# EAGLE design Copy #1 of 01 (EAGLE 5.09)
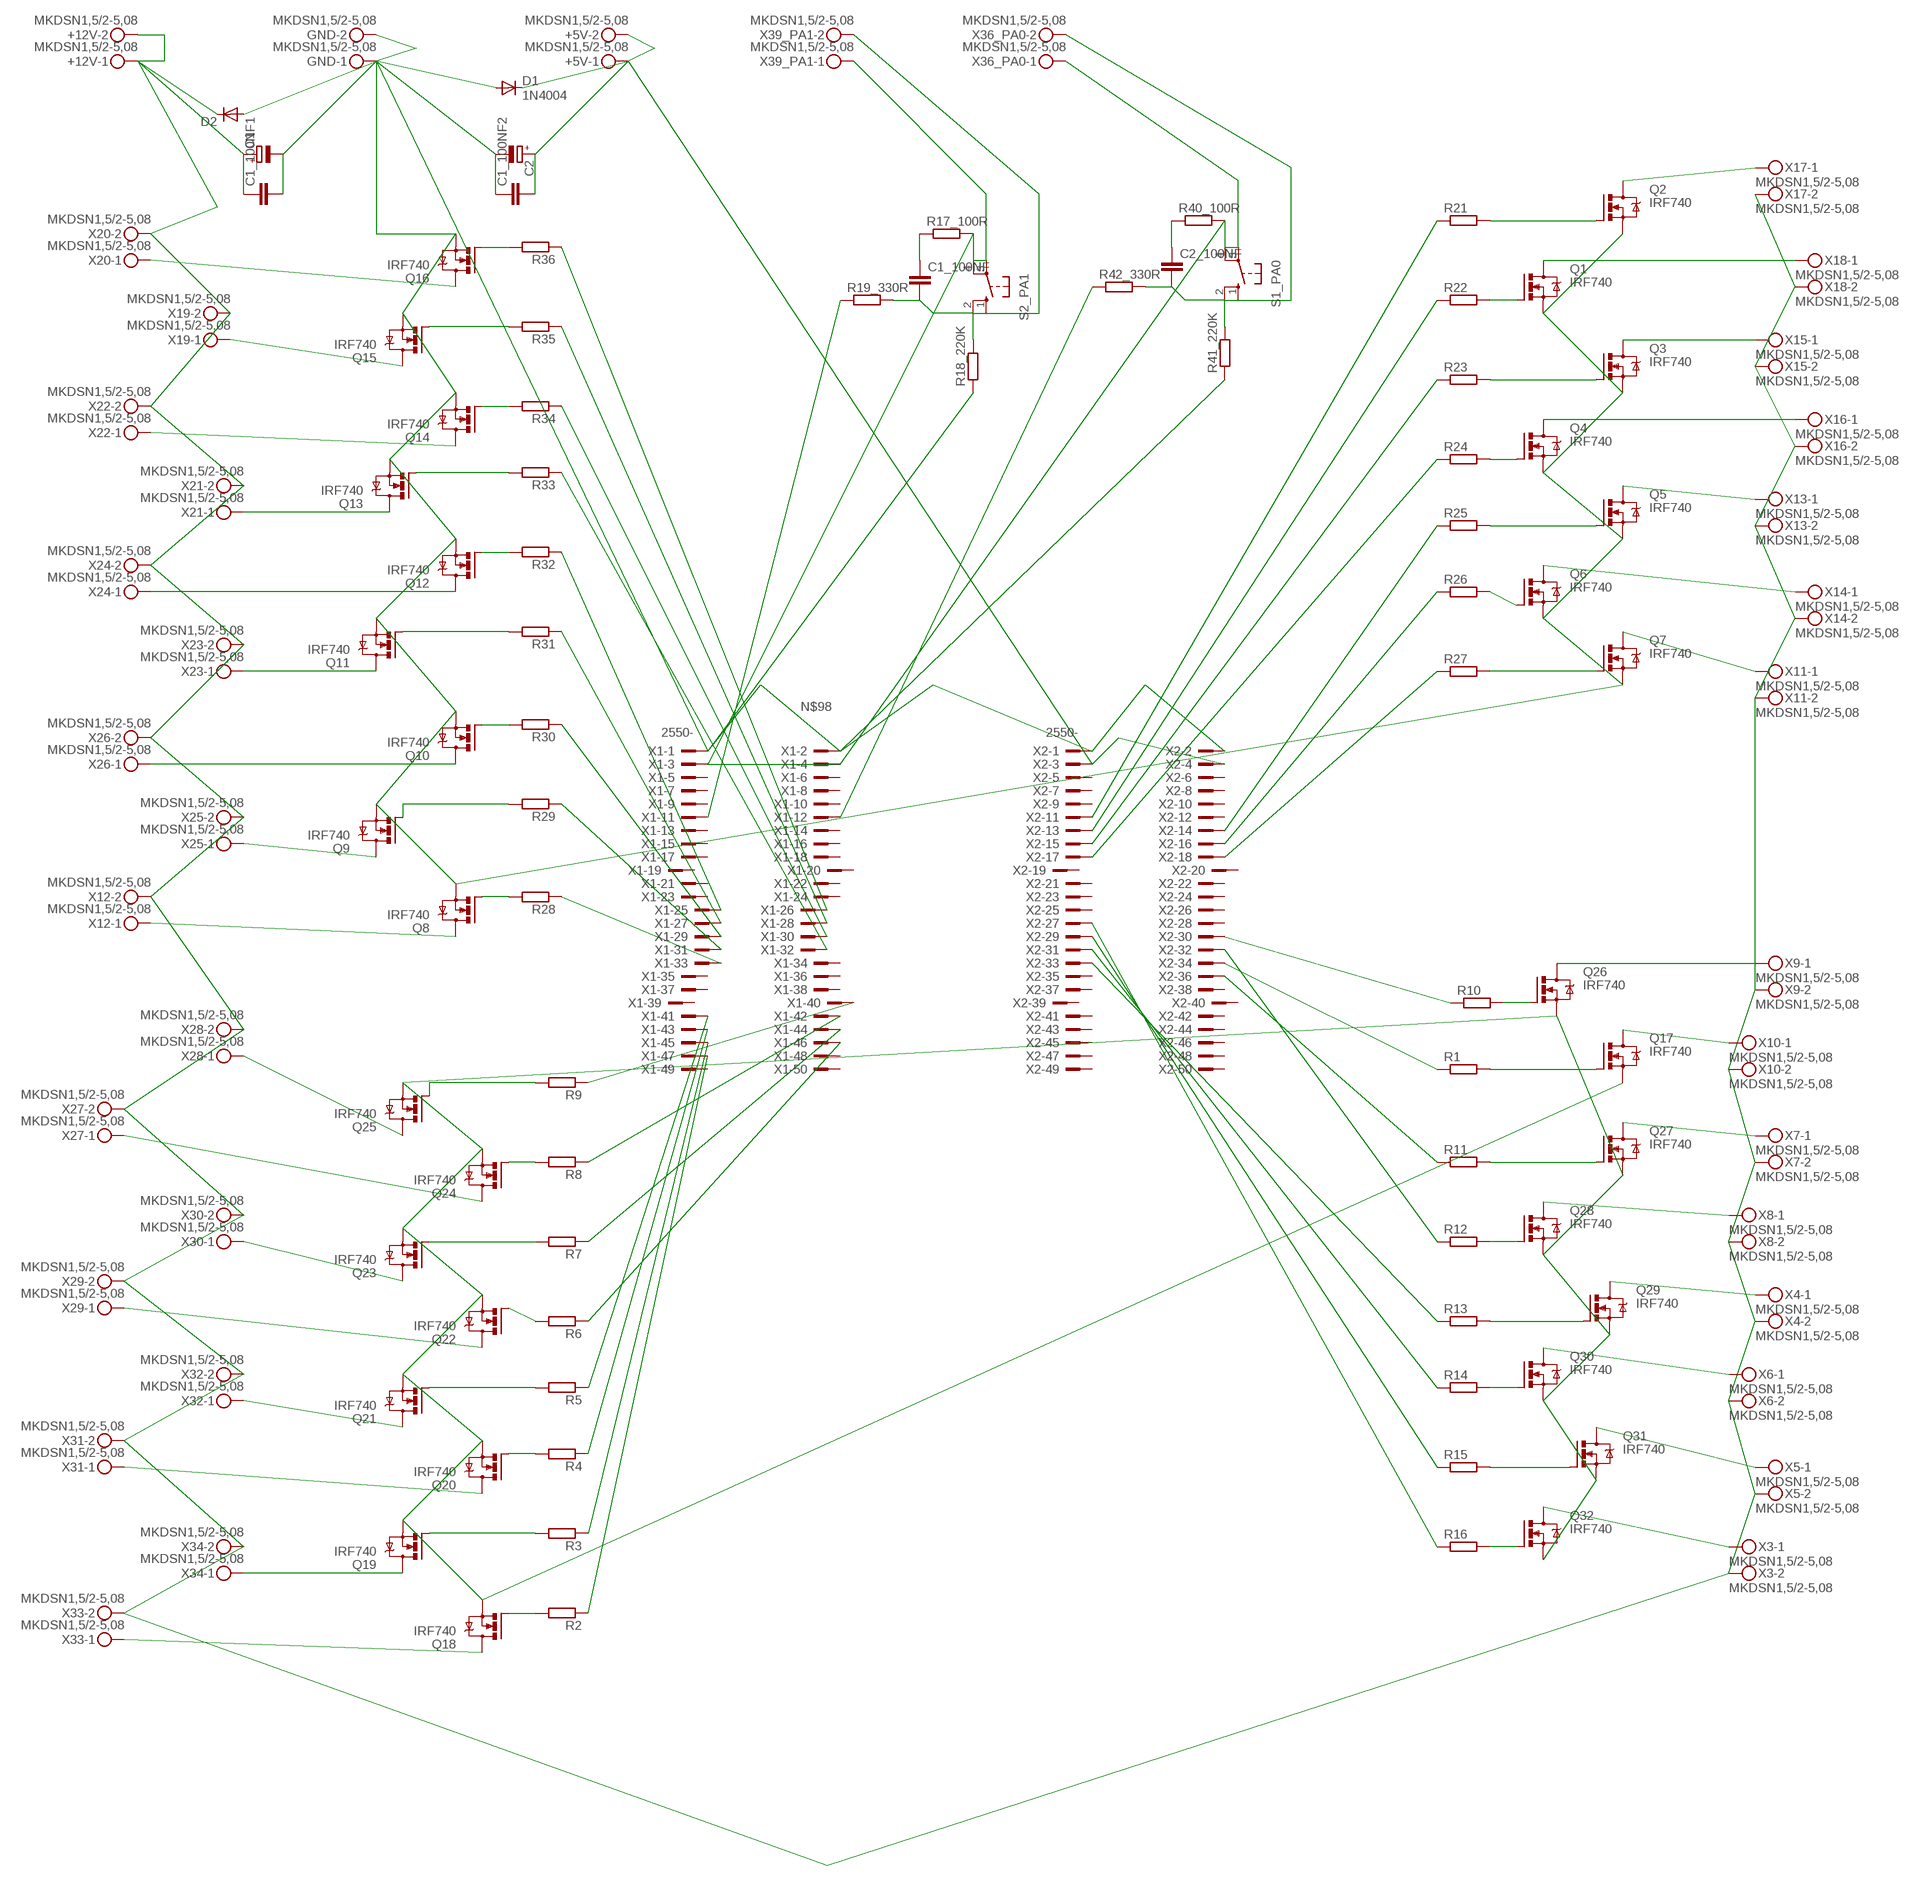
[diagram p0: schematic, sheet 1]

## Parts
+5V  MKDSN1,5/2-5,08  [MKDSN1,5/2-5,08]
+12V  MKDSN1,5/2-5,08  [MKDSN1,5/2-5,08]
C1  CPOL-EUTT5D10  [TT5D10]
C1_100NF  C-EU050-035X075  [C050-035X075]
C1_100NF1  C-EU050-035X075  [C050-035X075]
C1_100NF2  C-EU050-035X075  [C050-035X075]
C2  CPOL-EUTT5D10  [TT5D10]
C2_100NF  C-EU050-035X075  [C050-035X075]
D1  1N4004  [DO41-10]
D2  DIODE-C2673  [C2673]
GND  MKDSN1,5/2-5,08  [MKDSN1,5/2-5,08]
Q1  IRF740  [TO220BV]
Q2  IRF740  [TO220BV]
Q3  IRF740  [TO220BV]
Q4  IRF740  [TO220BV]
Q5  IRF740  [TO220BV]
Q6  IRF740  [TO220BV]
Q7  IRF740  [TO220BV]
Q8  IRF740  [TO220BV]
Q9  IRF740  [TO220BV]
Q10  IRF740  [TO220BV]
Q11  IRF740  [TO220BV]
Q12  IRF740  [TO220BV]
Q13  IRF740  [TO220BV]
Q14  IRF740  [TO220BV]
Q15  IRF740  [TO220BV]
Q16  IRF740  [TO220BV]
Q17  IRF740  [TO220BV]
Q18  IRF740  [TO220BV]
Q19  IRF740  [TO220BV]
Q20  IRF740  [TO220BV]
Q21  IRF740  [TO220BV]
Q22  IRF740  [TO220BV]
Q23  IRF740  [TO220BV]
Q24  IRF740  [TO220BV]
Q25  IRF740  [TO220BV]
Q26  IRF740  [TO220BV]
Q27  IRF740  [TO220BV]
Q28  IRF740  [TO220BV]
Q29  IRF740  [TO220BV]
Q30  IRF740  [TO220BV]
Q31  IRF740  [TO220BV]
Q32  IRF740  [TO220BV]
R1  R-EU_0207/10  [0207/10]
R2  R-EU_0207/10  [0207/10]
R3  R-EU_0207/10  [0207/10]
R4  R-EU_0207/10  [0207/10]
R5  R-EU_0207/10  [0207/10]
R6  R-EU_0207/10  [0207/10]
R7  R-EU_0207/10  [0207/10]
R8  R-EU_0207/10  [0207/10]
R9  R-EU_0207/10  [0207/10]
R10  R-EU_0207/10  [0207/10]
R11  R-EU_0207/10  [0207/10]
R12  R-EU_0207/10  [0207/10]
R13  R-EU_0207/10  [0207/10]
R14  R-EU_0207/10  [0207/10]
R15  R-EU_0207/10  [0207/10]
R16  R-EU_0207/10  [0207/10]
R17_100R  R-EU_0207/10  [0207/10]
R18_220K  R-EU_0207/10  [0207/10]
R19_330R  R-EU_0207/10  [0207/10]
R21  R-EU_0207/10  [0207/10]
R22  R-EU_0207/10  [0207/10]
R23  R-EU_0207/10  [0207/10]
R24  R-EU_0207/10  [0207/10]
R25  R-EU_0207/10  [0207/10]
R26  R-EU_0207/10  [0207/10]
R27  R-EU_0207/10  [0207/10]
R28  R-EU_0207/10  [0207/10]
R29  R-EU_0207/10  [0207/10]
R30  R-EU_0207/10  [0207/10]
R31  R-EU_0207/10  [0207/10]
R32  R-EU_0207/10  [0207/10]
R33  R-EU_0207/10  [0207/10]
R34  R-EU_0207/10  [0207/10]
R35  R-EU_0207/10  [0207/10]
R36  R-EU_0207/10  [0207/10]
R40_100R  R-EU_0207/10  [0207/10]
R41_220K  R-EU_0207/10  [0207/10]
R42_330R  R-EU_0207/10  [0207/10]
S1_PA0  10-XX  [B3F-10XX]
S2_PA1  10-XX  [B3F-10XX]
X1  2550-  [PAK100/2500-50]
X2  2550-  [PAK100/2500-50]
X3  MKDSN1,5/2-5,08  [MKDSN1,5/2-5,08]
X4  MKDSN1,5/2-5,08  [MKDSN1,5/2-5,08]
X5  MKDSN1,5/2-5,08  [MKDSN1,5/2-5,08]
X6  MKDSN1,5/2-5,08  [MKDSN1,5/2-5,08]
X7  MKDSN1,5/2-5,08  [MKDSN1,5/2-5,08]
X8  MKDSN1,5/2-5,08  [MKDSN1,5/2-5,08]
X9  MKDSN1,5/2-5,08  [MKDSN1,5/2-5,08]
X10  MKDSN1,5/2-5,08  [MKDSN1,5/2-5,08]
X11  MKDSN1,5/2-5,08  [MKDSN1,5/2-5,08]
X12  MKDSN1,5/2-5,08  [MKDSN1,5/2-5,08]
X13  MKDSN1,5/2-5,08  [MKDSN1,5/2-5,08]
X14  MKDSN1,5/2-5,08  [MKDSN1,5/2-5,08]
X15  MKDSN1,5/2-5,08  [MKDSN1,5/2-5,08]
X16  MKDSN1,5/2-5,08  [MKDSN1,5/2-5,08]
X17  MKDSN1,5/2-5,08  [MKDSN1,5/2-5,08]
X18  MKDSN1,5/2-5,08  [MKDSN1,5/2-5,08]
X19  MKDSN1,5/2-5,08  [MKDSN1,5/2-5,08]
X20  MKDSN1,5/2-5,08  [MKDSN1,5/2-5,08]
X21  MKDSN1,5/2-5,08  [MKDSN1,5/2-5,08]
X22  MKDSN1,5/2-5,08  [MKDSN1,5/2-5,08]
X23  MKDSN1,5/2-5,08  [MKDSN1,5/2-5,08]
X24  MKDSN1,5/2-5,08  [MKDSN1,5/2-5,08]
X25  MKDSN1,5/2-5,08  [MKDSN1,5/2-5,08]
X26  MKDSN1,5/2-5,08  [MKDSN1,5/2-5,08]
X27  MKDSN1,5/2-5,08  [MKDSN1,5/2-5,08]
X28  MKDSN1,5/2-5,08  [MKDSN1,5/2-5,08]
X29  MKDSN1,5/2-5,08  [MKDSN1,5/2-5,08]
X30  MKDSN1,5/2-5,08  [MKDSN1,5/2-5,08]
X31  MKDSN1,5/2-5,08  [MKDSN1,5/2-5,08]
X32  MKDSN1,5/2-5,08  [MKDSN1,5/2-5,08]
X33  MKDSN1,5/2-5,08  [MKDSN1,5/2-5,08]
X34  MKDSN1,5/2-5,08  [MKDSN1,5/2-5,08]
X36_PA0  MKDSN1,5/2-5,08  [MKDSN1,5/2-5,08]
X39_PA1  MKDSN1,5/2-5,08  [MKDSN1,5/2-5,08]

## Nets
N$1: Q2.G R21.2
N$2: Q17.G R1.2
N$3: Q18.G R2.2
N$4: Q19.G R3.2
N$5: Q20.G R4.2
N$6: Q23.G R7.2
N$7: Q22.G R6.2
N$8: Q21.G R5.2
N$9: Q24.G R8.2
N$10: Q25.G R9.2
N$11: Q26.G R10.2
N$12: Q32.G R16.2
N$13: Q31.G R15.2
N$14: Q30.G R14.2
N$15: Q29.G R13.2
N$16: Q28.G R12.2
N$17: Q27.G R11.2
N$18: Q1.G R22.2
N$19: Q3.G R23.2
N$20: Q4.G R24.2
N$21: Q7.G R27.2
N$22: Q6.G R26.2
N$23: Q5.G R25.2
N$24: Q8.G R28.2
N$25: Q9.G R29.2
N$26: Q10.G R30.2
N$27: Q16.G R36.2
N$28: Q15.G R35.2
N$29: Q14.G R34.2
N$30: Q13.G R33.2
N$31: Q12.G R32.2
N$32: Q11.G R31.2
N$34: Q17.S Q18.S Q19.S Q20.S Q21.S Q22.S Q23.S Q24.S Q25.S Q26.S Q27.S Q28.S Q29.S Q30.S Q31.S Q32.S
N$35: R2.1 X1.47
N$36: R3.1 X1.45
N$37: R4.1 X1.43
N$38: R5.1 X1.41
N$39: R6.1 X1.46
N$40: R7.1 X1.44
N$41: R8.1 X1.42
N$42: R9.1 X1.40
N$43: R10.1 X2.30
N$44: R11.1 X2.36
N$45: R1.1 X2.34
N$46: R12.1 X2.32
N$47: R13.1 X2.33
N$48: R14.1 X2.31
N$49: R15.1 X2.29
N$50: R16.1 X2.27
N$51: R21.1 X2.11
N$52: R22.1 X2.13
N$53: R23.1 X2.15
N$54: R24.1 X2.17
N$55: R25.1 X2.14
N$56: R26.1 X2.16
N$57: R27.1 X2.18
N$58: R28.1 X1.33
N$59: R36.1 X1.26
N$60: R35.1 X1.28
N$61: R34.1 X1.30
N$62: R33.1 X1.32
N$63: R32.1 X1.25
N$64: R31.1 X1.27
N$65: R30.1 X1.29
N$66: R29.1 X1.31
N$67: Q7.D X11.1
N$68: Q6.D X14.1
N$69: Q5.D X13.1
N$70: Q4.D X16.1
N$71: Q3.D X15.1
N$72: Q1.D X18.1
N$73: Q2.D X17.1
N$74: Q26.D X9.1
N$75: Q17.D X10.1
N$76: Q27.D X7.1
N$77: Q28.D X8.1
N$78: Q29.D X4.1
N$79: Q30.D X6.1
N$80: Q31.D X5.1
N$81: Q32.D X3.1
N$82: Q18.D X33.1
N$83: Q19.D X34.1
N$84: Q20.D X31.1
N$85: Q21.D X32.1
N$86: Q22.D X29.1
N$87: Q23.D X30.1
N$88: Q24.D X27.1
N$89: Q25.D X28.1
N$90: Q8.D X12.1
N$91: Q9.D X25.1
N$92: Q10.D X26.1
N$93: Q11.D X23.1
N$94: Q12.D X24.1
N$95: Q13.D X21.1
N$96: Q14.D X22.1
N$97: Q15.D X19.1
N$98: C1.- C1_100NF1.2 C1_100NF2.1 C2.- D1.A D2.A GND.1 GND.2 Q1.S Q2.S Q3.S Q4.S Q5.S Q6.S Q7.S Q8.S Q9.S Q10.S Q11.S Q12.S Q13.S Q14.S Q15.S Q16.S R18_220K.1 R41_220K.1 X1.1 X1.2 X2.1 X2.2
N$99: +12V.1 +12V.2 C1.+ C1_100NF1.1 D2.C X3.2 X4.2 X5.2 X6.2 X7.2 X8.2 X9.2 X10.2 X11.2 X12.2 X13.2 X14.2 X15.2 X16.2 X17.2 X18.2 X19.2 X20.2 X21.2 X22.2 X23.2 X24.2 X25.2 X26.2 X27.2 X28.2 X29.2 X30.2 X31.2 X32.2 X33.2 X34.2
N$100: +5V.1 +5V.2 C1_100NF2.2 C2.+ D1.C X2.3 X2.4
N$101: C2_100NF.2 R41_220K.2 R42_330R.2 S1_PA0.1(S) S1_PA0.2(S1) X36_PA0.2
N$102: C2_100NF.1 R40_100R.1
N$103: Q16.D X20.1
N$104: C1_100NF.2 R18_220K.2 R19_330R.2 S2_PA1.1(S) S2_PA1.2(S1) X39_PA1.2
N$105: C1_100NF.1 R17_100R.1
N$106: R17_100R.2 R40_100R.2 S1_PA0.3(P) S1_PA0.4(P1) S2_PA1.3(P) S2_PA1.4(P1) X1.3 X1.4 X36_PA0.1 X39_PA1.1
N$107: R19_330R.1 X1.11
N$108: R42_330R.1 X1.12
Unconnected: X1.5 X1.6 X1.7 X1.8 X1.9 X1.10 X1.13 X1.14 X1.15 X1.16 X1.17 X1.18 X1.19 X1.20 X1.21 X1.22 X1.23 X1.24 X1.34 X1.35 X1.36 X1.37 X1.38 X1.39 X1.48 X1.49 X1.50 X2.5 X2.6 X2.7 X2.8 X2.9 X2.10 X2.12 X2.19 X2.20 X2.21 X2.22 X2.23 X2.24 X2.25 X2.26 X2.28 X2.35 X2.37 X2.38 X2.39 X2.40 X2.41 X2.42 X2.43 X2.44 X2.45 X2.46 X2.47 X2.48 X2.49 X2.50

## Library data of the parts
+5V +12V GND X3-X34 X36_PA0 X39_PA1 = con-phoenix-508:MKDSN1,5/2-5,08: MKDSN 1,5/ 2-5,08 Printklemme Nennstrom: 13,5 A Nennspannung: 250 V Rastermaß: 5,08 mm Polzahl: 2 Anschlussart: Schraubanschluss Montage: Löten Anschlussrichtung Leiter/Platine: 0 ° Artikelnummer: 1729128 Source: http://eshop.phoenixcontact.com .. 1729128.pdf
C1 C2 = resistor:CPOL-EU: POLARIZED CAPACITOR, European symbol
C1_100NF C1_100NF1 C1_100NF2 C2_100NF = resistor:C-EU: CAPACITOR, European symbol
D1 = diode:1N4004: DIODE general purpose rectifier, 1 A
D2 = diode:DIODE-: DIODE
Q1-Q32 = transistor-power:IRF740: N-CHANNEL MOS FET
R1-R16 R17_100R R18_220K R19_330R R21-R36 R40_100R R41_220K R42_330R = resistor:R-EU_: RESISTOR, European symbol
S1_PA0 S2_PA1 = switch-omron:10-XX: OMRON SWITCH
X1 X2 = con-3m:2550-: 3M (TM) Pak 100 4-Wall Header Source: 3M

## Board
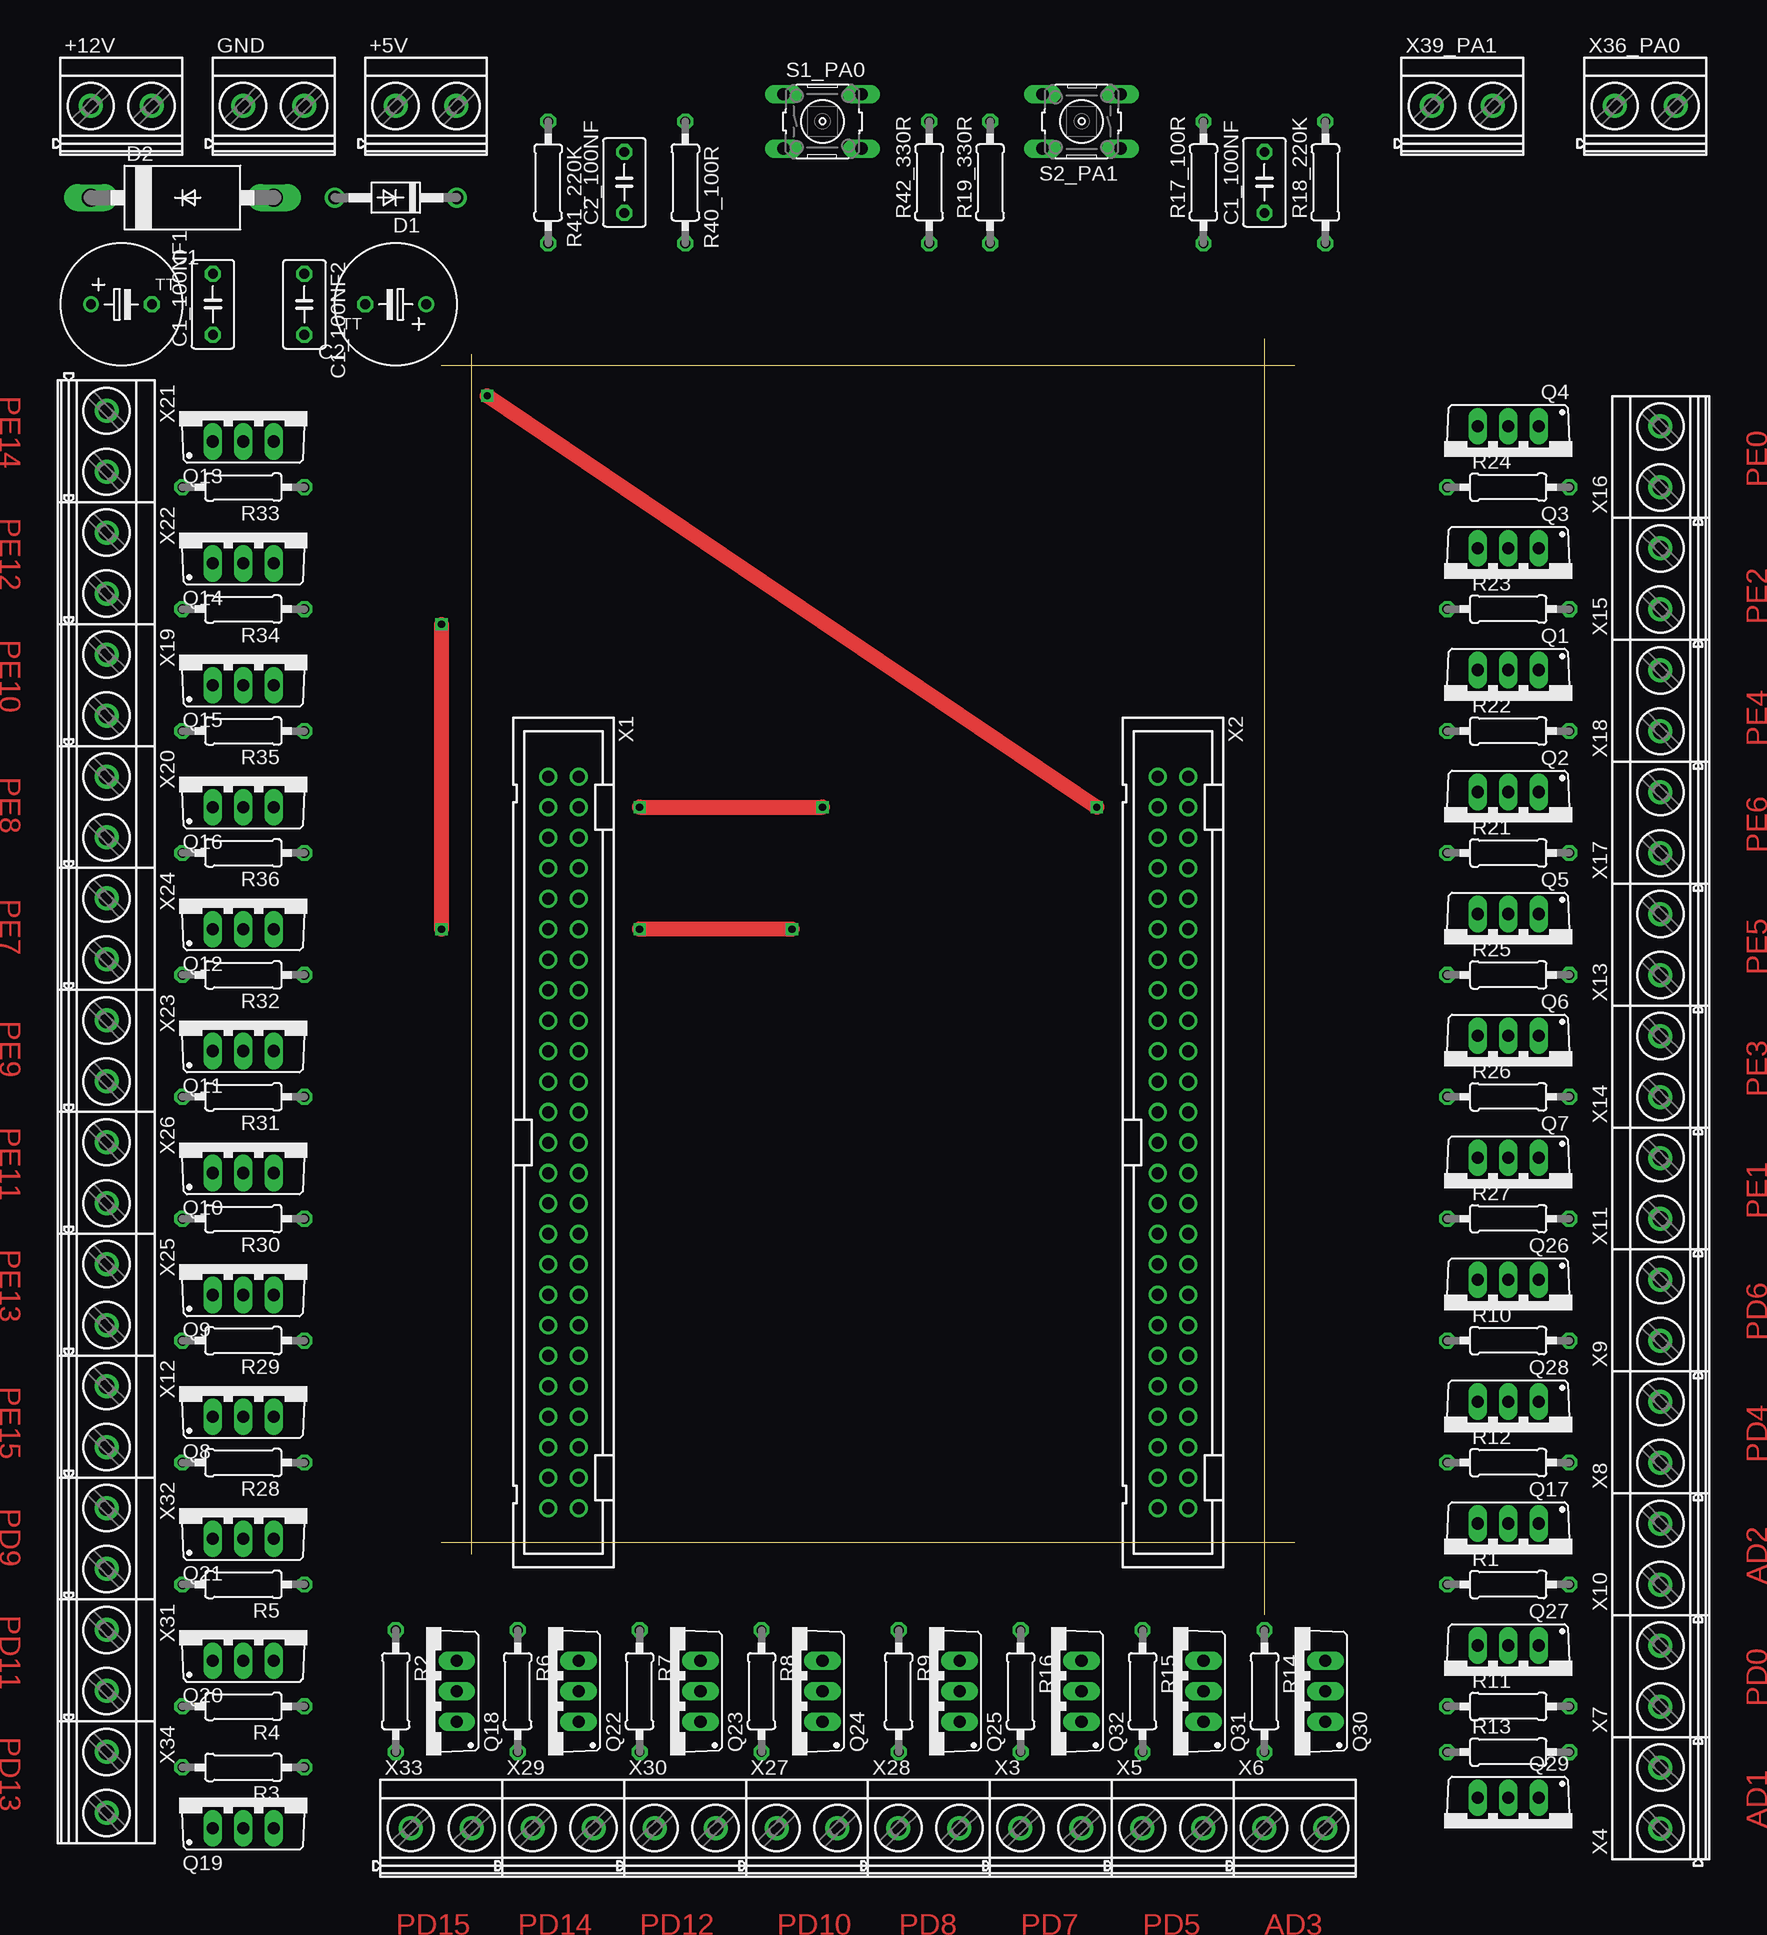
[diagram p1: board, top side]
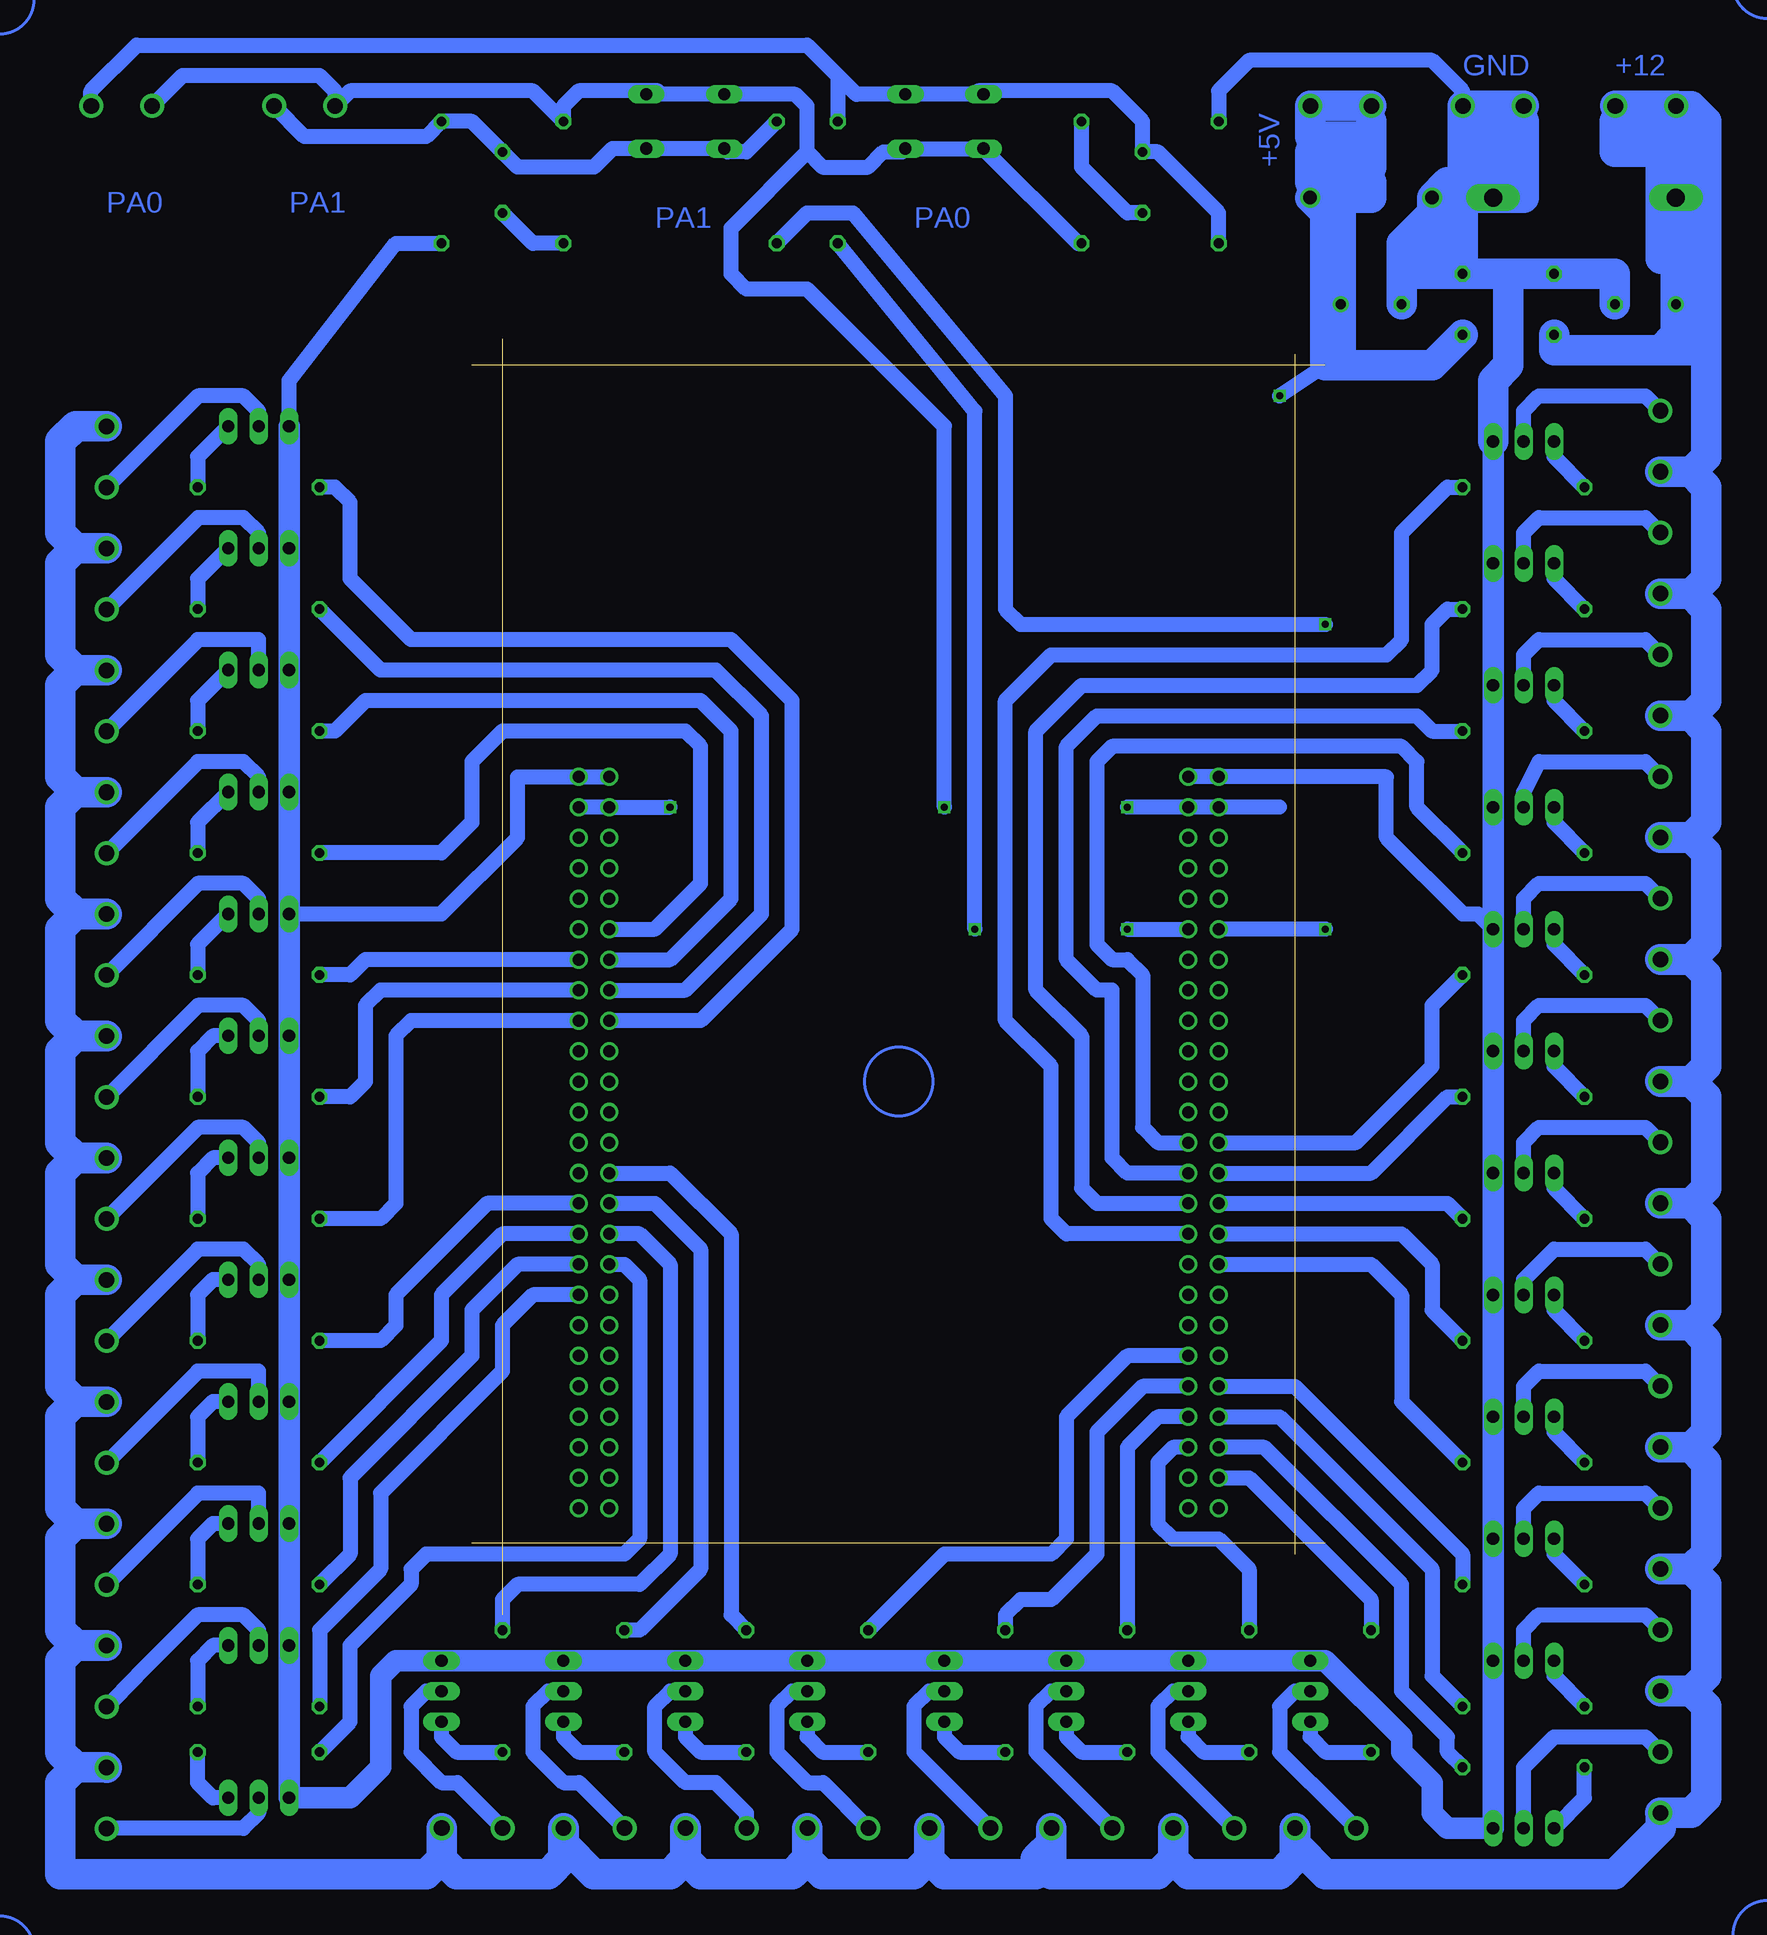
[diagram p2: board, bottom side, seen from below]

Size 71.12 x 106.35 mm. Coordinates in mm from the lower left corner, seen from the top.
Outline: 2.52,5.08 2.52,105.08
Outline: 68.58,106.35 68.58,0
Outline: 71.12,6.02 0,6.02
Outline: 0,104.14 71.12,104.14
Copper layers (1*16): Top 0.035mm / dielectric 1.5mm / Bottom 0.035mm
Design rules "default": minimum track width 10mil, minimum drill 24mil, track to track 8mil, track to pad 8mil, pad to pad 8mil, via to via 8mil, smd to smd 8mil, copper to edge 40mil, drill to drill 8mil, minimum pad ring 10mil, minimum via ring 8mil, stop-mask expansion 4mil, vias tented up to drill 0mil, thermal gap 10mil

### Footprints (pad centres in the part's own frame; a part is rotated, then mirrored left to right if it is on the bottom)
MKDSN1,5/2-5,08 = drill 1.3 pad 2 round: 1 -2.561,0.025; 2 2.519,0.025
TT5D10 = drill 0.813 round: + -2.54,0 | drill 0.813 octagon: - 2.54,0
C050-035X075 = drill 0.813 octagon: 1 -2.54,0; 2 2.54,0
DO41-10 = drill 1.118 round: A 5.08,0; C -5.08,0
C2673 = drill 1.499 long: A 7.62,0; C -7.62,0
TO220BV = drill 1.016 long: D 0,-2.54; G -2.54,-2.54; S 2.54,-2.54
0207/10 = drill 0.813 octagon: 1 -5.08,0; 2 5.08,0
B3F-10XX = drill 1.016 long: 1 -3.251,2.261; 2 3.251,2.261; 3 -3.251,-2.261; 4 3.251,-2.261
PAK100/2500-50 = drill 1 pad 1.422 round: 1 -30.48,-1.27; 2 -30.48,1.27; 3 -27.94,-1.27; 4 -27.94,1.27; 5 -25.4,-1.27; 6 -25.4,1.27; 7 -22.86,-1.27; 8 -22.86,1.27; 9 -20.32,-1.27; 10 -20.32,1.27; 11 -17.78,-1.27; 12 -17.78,1.27; 13 -15.24,-1.27; 14 -15.24,1.27; 15 -12.7,-1.27; 16 -12.7,1.27; 17 -10.16,-1.27; 18 -10.16,1.27; 19 -7.62,-1.27; 20 -7.62,1.27; 21 -5.08,-1.27; 22 -5.08,1.27; 23 -2.54,-1.27; 24 -2.54,1.27; 25 0,-1.27; 26 0,1.27; 27 2.54,-1.27; 28 2.54,1.27; 29 5.08,-1.27; 30 5.08,1.27; 31 7.62,-1.27; 32 7.62,1.27; 33 10.16,-1.27; 34 10.16,1.27; 35 12.7,-1.27; 36 12.7,1.27; 37 15.24,-1.27; 38 15.24,1.27; 39 17.78,-1.27; 40 17.78,1.27; 41 20.32,-1.27; 42 20.32,1.27; 43 22.86,-1.27; 44 22.86,1.27; 45 25.4,-1.27; 46 25.4,1.27; 47 27.94,-1.27; 48 27.94,1.27; 49 30.48,-1.27; 50 30.48,1.27

### Placement (x,y rotation side)
+5V  -1.27,125.73 0 top  (outside the outline)
+12V  -26.67,125.73 0 top  (outside the outline)
C1  -26.67,109.22 0 top  (outside the outline)
C1_100NF  68.58,119.38 90 top  (outside the outline)
C1_100NF1  -19.05,109.22 90 top  (outside the outline)
C1_100NF2  -11.43,109.22 270 top  (outside the outline)
C2  -3.81,109.22 180 top
C2_100NF  15.24,119.38 90 top  (outside the outline)
D1  -3.81,118.11 180 top  (outside the outline)
D2  -21.59,118.11 0 top  (outside the outline)
GND  -13.97,125.73 0 top  (outside the outline)
Q1  88.9,76.2 180 top  (outside the outline)
Q2  88.9,66.04 180 top  (outside the outline)
Q3  88.9,86.36 180 top  (outside the outline)
Q4  88.9,96.52 180 top  (outside the outline)
Q5  88.9,55.88 180 top  (outside the outline)
Q6  88.9,45.72 180 top  (outside the outline)
Q7  88.9,35.56 180 top  (outside the outline)
Q8  -16.51,19.05 0 top  (outside the outline)
Q9  -16.51,29.21 0 top  (outside the outline)
Q10  -16.51,39.37 0 top  (outside the outline)
Q11  -16.51,49.53 0 top  (outside the outline)
Q12  -16.51,59.69 0 top  (outside the outline)
Q13  -16.51,100.33 0 top  (outside the outline)
Q14  -16.51,90.17 0 top  (outside the outline)
Q15  -16.51,80.01 0 top  (outside the outline)
Q16  -16.51,69.85 0 top  (outside the outline)
Q17  88.9,5.08 180 top  (outside the outline)
Q18  -1.27,-6.35 90 top  (outside the outline)
Q19  -16.51,-15.24 0 top  (outside the outline)
Q20  -16.51,-1.27 0 top  (outside the outline)
Q21  -16.51,8.89 0 top  (outside the outline)
Q22  8.89,-6.35 90 top  (outside the outline)
Q23  19.05,-6.35 90 top  (outside the outline)
Q24  29.21,-6.35 90 top  (outside the outline)
Q25  40.64,-6.35 90 top  (outside the outline)
Q26  88.9,25.4 180 top  (outside the outline)
Q27  88.9,-5.08 180 top  (outside the outline)
Q28  88.9,15.24 180 top  (outside the outline)
Q29  88.9,-17.78 180 top  (outside the outline)
Q30  71.12,-6.35 90 top  (outside the outline)
Q31  60.96,-6.35 90 top  (outside the outline)
Q32  50.8,-6.35 90 top  (outside the outline)
R1  88.9,2.54 0 top  (outside the outline)
R2  -3.81,-6.35 270 top  (outside the outline)
R3  -16.51,-12.7 180 top  (outside the outline)
R4  -16.51,-7.62 180 top  (outside the outline)
R5  -16.51,2.54 180 top  (outside the outline)
R6  6.35,-6.35 270 top
R7  16.51,-6.35 270 top
R8  26.67,-6.35 270 top
R9  38.1,-6.35 270 top
R10  88.9,22.86 0 top  (outside the outline)
R11  88.9,-7.62 0 top  (outside the outline)
R12  88.9,12.7 0 top  (outside the outline)
R13  88.9,-11.43 0 top  (outside the outline)
R14  68.58,-6.35 270 top
R15  58.42,-6.35 270 top
R16  48.26,-6.35 270 top
R17_100R  63.5,119.38 90 top  (outside the outline)
R18_220K  73.66,119.38 90 top  (outside the outline)
R19_330R  45.72,119.38 90 top  (outside the outline)
R21  88.9,63.5 0 top  (outside the outline)
R22  88.9,73.66 0 top  (outside the outline)
R23  88.9,83.82 0 top  (outside the outline)
R24  88.9,93.98 0 top  (outside the outline)
R25  88.9,53.34 0 top  (outside the outline)
R26  88.9,43.18 0 top  (outside the outline)
R27  88.9,33.02 0 top  (outside the outline)
R28  -16.51,12.7 180 top  (outside the outline)
R29  -16.51,22.86 180 top  (outside the outline)
R30  -16.51,33.02 180 top  (outside the outline)
R31  -16.51,43.18 180 top  (outside the outline)
R32  -16.51,53.34 180 top  (outside the outline)
R33  -16.51,93.98 180 top  (outside the outline)
R34  -16.51,83.82 180 top  (outside the outline)
R35  -16.51,73.66 180 top  (outside the outline)
R36  -16.51,63.5 180 top  (outside the outline)
R40_100R  20.32,119.38 270 top  (outside the outline)
R41_220K  8.89,119.38 270 top  (outside the outline)
R42_330R  40.64,119.38 90 top  (outside the outline)
S1_PA0  31.75,124.46 0 top  (outside the outline)
S2_PA1  53.34,124.46 180 top  (outside the outline)
X1  10.16,39.37 270 top
X2  60.96,39.37 270 top
X3  50.8,-17.78 0 top  (outside the outline)
X4  101.6,-15.24 90 top  (outside the outline)
X5  60.96,-17.78 0 top  (outside the outline)
X6  71.12,-17.78 0 top  (outside the outline)
X7  101.6,-5.08 90 top  (outside the outline)
X8  101.6,15.24 90 top  (outside the outline)
X9  101.6,25.4 90 top  (outside the outline)
X10  101.6,5.08 90 top  (outside the outline)
X11  101.6,35.56 90 top  (outside the outline)
X12  -27.94,16.51 270 top  (outside the outline)
X13  101.6,55.88 90 top  (outside the outline)
X14  101.6,45.72 90 top  (outside the outline)
X15  101.6,86.36 90 top  (outside the outline)
X16  101.6,96.52 90 top  (outside the outline)
X17  101.6,66.04 90 top  (outside the outline)
X18  101.6,76.2 90 top  (outside the outline)
X19  -27.94,77.47 270 top  (outside the outline)
X20  -27.94,67.31 270 top  (outside the outline)
X21  -27.94,97.79 270 top  (outside the outline)
X22  -27.94,87.63 270 top  (outside the outline)
X23  -27.94,46.99 270 top  (outside the outline)
X24  -27.94,57.15 270 top  (outside the outline)
X25  -27.94,26.67 270 top  (outside the outline)
X26  -27.94,36.83 270 top  (outside the outline)
X27  30.48,-17.78 0 top  (outside the outline)
X28  40.64,-17.78 0 top  (outside the outline)
X29  10.16,-17.78 0 top  (outside the outline)
X30  20.32,-17.78 0 top  (outside the outline)
X31  -27.94,-3.81 270 top  (outside the outline)
X32  -27.94,6.35 270 top  (outside the outline)
X33  0,-17.78 0 top  (outside the outline)
X34  -27.94,-13.97 270 top  (outside the outline)
X36_PA0  100.33,125.73 0 top  (outside the outline)
X39_PA1  85.09,125.73 0 top  (outside the outline)

### Tracks (layer width: path | path; a pad name or v marks a point on that pad's centre or on a via)
N$1
  Bottom 1.27: Q2.G 93.98,66.04 R21.2
N$2
  Bottom 1.27: Q17.G 92.71,7.62 93.98,6.35 R1.2
N$3
  Bottom 1.27: Q18.G 1.27,-10.16 0,-11.43 R2.2
N$4
  Bottom 1.27: Q19.G -21.59,-15.24 R3.2
N$5
  Bottom 1.27: Q20.G -19.05,-5.08 R4.2
N$6
  Bottom 1.27: Q23.G 21.59,-10.16 20.32,-11.43 R7.2
N$7
  Bottom 1.27: Q22.G 11.43,-10.16 10.16,-11.43 R6.2
N$8
  Bottom 1.27: Q21.G -19.05,5.08 R5.2
N$9
  Bottom 1.27: Q24.G 31.75,-10.16 30.48,-11.43 R8.2
N$10
  Bottom 1.27: Q25.G 43.18,-10.16 41.91,-11.43 R9.2
N$11
  Bottom 1.27: Q26.G 92.71,27.94 93.98,26.67 R10.2
N$12
  Bottom 1.27: Q32.G 53.34,-10.16 52.07,-11.43 R16.2
N$13
  Bottom 1.27: Q31.G 63.5,-10.16 62.23,-11.43 R15.2
N$14
  Bottom 1.27: Q30.G 73.66,-10.16 72.39,-11.43 R14.2
N$15
  Bottom 1.27: Q29.G 92.71,-15.24 93.98,-13.97 R13.2
N$16
  Bottom 1.27: Q28.G 92.71,17.78 93.98,16.51 R12.2
N$17
  Bottom 1.27: Q27.G 92.71,-2.54 93.98,-3.81 R11.2
N$18
  Bottom 1.27: Q1.G 93.98,76.2 R22.2
N$19
  Bottom 1.27: Q3.G 93.98,86.36 R23.2
N$20
  Bottom 1.27: Q4.G 93.98,96.52 R24.2
N$21
  Bottom 1.27: Q7.G 92.71,38.1 93.98,36.83 R27.2
N$22
  Bottom 1.27: Q6.G 92.71,48.26 93.98,46.99 R26.2
N$23
  Bottom 1.27: Q5.G 93.98,55.88 R25.2
N$24
  Bottom 1.27: Q8.G -19.05,15.24 R28.2
N$25
  Bottom 1.27: Q9.G -19.05,25.4 R29.2
N$26
  Bottom 1.27: Q10.G -19.05,35.56 R30.2
N$27
  Bottom 1.27: Q16.G -19.05,66.04 R36.2
N$28
  Bottom 1.27: Q15.G -19.05,76.2 R35.2
N$29
  Bottom 1.27: Q14.G -19.05,86.36 R34.2
N$30
  Bottom 1.27: Q13.G -19.05,96.52 R33.2
N$31
  Bottom 1.27: Q12.G -19.05,55.88 R32.2
N$32
  Bottom 1.27: Q11.G -19.05,45.72 R31.2
N$34
  Bottom 1.778: Q21.S Q20.S Q19.S -10.16,-17.78 -8.89,-16.51 -8.89,-13.97 -6.35,-11.43 -6.35,-10.16 0,-3.81 Q18.S Q22.S Q23.S Q24.S Q25.S Q32.S Q31.S Q30.S 77.47,-3.81 78.74,-5.08 78.74,-12.7 81.28,-15.24 Q29.S Q27.S Q17.S Q28.S Q26.S
N$35
  Bottom 1.27: X1.47 6.35,11.43 -3.81,1.27 R2.1
N$36
  Bottom 1.27: X1.45 5.08,13.97 -6.35,2.54 -6.35,-6.35 -10.16,-10.16 -10.16,-11.43 R3.1
N$37
  Bottom 1.27: X1.43 3.81,16.51 -8.89,3.81 -8.89,-5.08 R4.1
N$38
  Bottom 1.27: X1.41 2.54,19.05 -11.43,5.08 R5.1
N$39
  Bottom 1.27: X1.46 12.7,13.97 13.97,12.7 13.97,7.62 12.7,6.35 8.89,6.35 6.35,3.81 R6.1
N$40
  Bottom 1.27: X1.44 13.97,16.51 16.51,13.97 R7.1
N$41
  Bottom 1.27: X1.42 15.24,19.05 19.05,15.24 19.05,5.08 22.86,1.27 25.4,1.27 26.67,0 R8.1
N$42
  Bottom 1.27: X1.40 16.51,21.59 21.59,16.51 21.59,6.35 22.86,5.08 31.75,5.08 R9.1
N$43
  Bottom 1.27: X2.30 69.85,34.29 77.47,26.67 77.47,24.13 78.74,22.86 R10.1
N$44
  Bottom 1.27: X2.36 66.04,26.67 68.58,24.13 68.58,20.32 78.74,10.16 78.74,3.81 83.82,-1.27 R11.1
N$45
  Bottom 1.27: X2.34 67.31,29.21 71.12,25.4 71.12,21.59 81.28,11.43 81.28,5.08 R1.1
N$46
  Bottom 1.27: X2.32 68.58,31.75 73.66,26.67 73.66,22.86 R12.1
N$47
  Bottom 1.27: R13.1 81.28,-8.89 81.28,-2.54 76.2,2.54 76.2,3.81 74.93,5.08 58.42,5.08 57.15,6.35 57.15,27.94 58.42,29.21 X2.33
N$48
  Bottom 1.27: X2.31 57.15,31.75 54.61,29.21 54.61,5.08 57.15,2.54 67.31,2.54 68.58,1.27 R14.1
N$49
  Bottom 1.27: X2.29 55.88,34.29 52.07,30.48 52.07,3.81 57.15,-1.27 R15.1
N$50
  Bottom 1.27: X2.27 54.61,36.83 49.53,31.75 49.53,0 R16.1
N$51
  Bottom 1.27: X2.11 55.88,57.15 52.07,60.96 52.07,72.39 53.34,73.66 68.58,73.66 71.12,71.12 71.12,66.04 73.66,63.5 R21.1
N$52
  Bottom 1.27: X2.13 54.61,54.61 49.53,59.69 49.53,73.66 52.07,76.2 80.01,76.2 82.55,73.66 R22.1
N$53
  Bottom 1.27: X2.15 53.34,52.07 46.99,58.42 46.99,74.93 50.8,78.74 78.74,78.74 R23.1
N$54
  Bottom 1.27: X2.17 52.07,49.53 44.45,57.15 44.45,76.2 49.53,81.28 76.2,81.28 81.28,86.36 81.28,92.71 82.55,93.98 R24.1
N$55
  Bottom 1.27: X2.14 80.01,54.61 81.28,53.34 R25.1
N$56
  Bottom 1.27: X2.16 78.74,52.07 80.01,50.8 80.01,44.45 81.28,43.18 R26.1
N$57
  Bottom 1.27: X2.18 76.2,49.53 77.47,48.26 77.47,34.29 78.74,33.02 R27.1
N$58
  Bottom 1.27: X1.33 -3.81,29.21 -6.35,26.67 -6.35,17.78 R28.1
N$59
  Bottom 1.27: X1.26 13.97,39.37 15.24,40.64 15.24,53.34 16.51,54.61 17.78,54.61 19.05,55.88 19.05,71.12 17.78,72.39 -6.35,72.39 -7.62,71.12 -7.62,67.31 R36.1
N$60
  Bottom 1.27: X1.28 16.51,36.83 17.78,38.1 17.78,52.07 19.05,52.07 21.59,54.61 21.59,72.39 19.05,74.93 -7.62,74.93 -8.89,73.66 R35.1
N$61
  Bottom 1.27: X1.30 19.05,34.29 20.32,35.56 20.32,48.26 24.13,52.07 24.13,73.66 20.32,77.47 -7.62,77.47 -8.89,78.74 -8.89,82.55 -10.16,83.82 R34.1
N$62
  Bottom 1.27: X1.32 21.59,31.75 22.86,33.02 22.86,45.72 26.67,49.53 26.67,76.2 22.86,80.01 -5.08,80.01 -6.35,81.28 -6.35,90.17 -10.16,93.98 R33.1
N$63
  Bottom 1.27: X1.25 -2.54,39.37 -8.89,45.72 -8.89,50.8 R32.1
N$64
  Bottom 1.27: X1.27 -3.81,36.83 -10.16,43.18 R31.1
N$65
  Bottom 1.27: X1.29 -10.16,34.29 R30.1
N$66
  Bottom 1.27: X1.31 -6.35,31.75 -8.89,29.21 -8.89,25.4 R29.1
N$67
  Bottom 1.27: Q7.D 88.9,39.37 90.17,40.64 93.98,40.64 93.98,40.59 X11.1
N$68
  Bottom 1.27: Q6.D 88.9,49.53 90.17,50.8 93.98,50.8 93.98,50.75 X14.1
N$69
  Bottom 1.27: Q5.D 88.9,59.69 90.17,60.96 93.98,60.96 93.98,60.91 X13.1
N$70
  Bottom 1.27: Q4.D 88.9,100.33 90.17,101.6 93.93,101.6 X16.1
N$71
  Bottom 1.27: Q3.D 88.9,90.17 90.17,91.44 93.93,91.44 X15.1
N$72
  Bottom 1.27: Q1.D 88.9,81.28 93.98,81.28 93.98,81.23 X18.1
N$73
  Bottom 1.27: Q2.D 88.9,69.85 90.17,71.12 93.98,71.12 93.98,71.07 X17.1
N$74
  Bottom 1.27: Q26.D 88.9,29.21 90.17,30.48 93.98,30.48 93.98,30.43 X9.1
N$75
  Bottom 1.27: Q17.D 88.9,10.16 93.98,10.16 93.98,10.11 X10.1
N$76
  Bottom 1.27: Q27.D 88.9,-1.27 90.17,0 93.98,0 99.06,-5.08 99.06,-5.13 X7.1
N$77
  Bottom 1.27: Q28.D 88.9,20.32 93.98,20.32 93.98,20.27 X8.1
N$78
  Bottom 1.27: Q29.D 88.9,-16.51 90.17,-17.78 101.55,-17.78 X4.1
N$79
  Bottom 1.27: Q30.D 74.93,-6.35 76.2,-7.62 76.2,-11.43 73.66,-13.97 72.34,-13.97 X6.1
N$80
  Bottom 1.27: Q31.D 64.77,-6.35 66.04,-7.62 66.04,-11.43 63.5,-13.97 62.18,-13.97 X5.1
N$81
  Bottom 1.27: Q32.D 54.61,-6.35 55.88,-7.62 55.88,-11.43 53.34,-13.97 50.8,-13.97 48.26,-16.51 48.26,-17.73 X3.1
N$82
  Bottom 1.27: Q18.D 2.54,-6.35 3.81,-7.62 3.81,-11.43 1.27,-13.97 1.22,-13.97 X33.1
N$83
  Bottom 1.27: Q19.D -16.51,-12.7 -19.05,-10.16 -26.67,-10.16 -27.94,-11.43 X34.1
N$84
  Bottom 1.27: Q20.D -16.51,-1.27 -17.78,0 -26.67,0 X31.1
N$85
  Bottom 1.27: Q21.D -16.51,8.89 -17.78,10.16 -26.67,10.16 X32.1
N$86
  Bottom 1.27: Q22.D 12.7,-6.35 13.97,-7.62 13.97,-11.43 13.92,-11.43 X29.1
N$87
  Bottom 1.27: Q23.D 22.86,-6.35 24.13,-7.62 24.13,-11.43 24.08,-11.43 X30.1
N$88
  Bottom 1.27: Q24.D 33.02,-6.35 34.29,-7.62 34.29,-11.43 34.24,-11.43 X27.1
N$89
  Bottom 1.27: Q25.D 44.45,-6.35 45.72,-7.62 45.72,-11.43 43.18,-13.97 41.86,-13.97 X28.1
N$90
  Bottom 1.27: Q8.D -16.51,19.05 -17.78,20.32 -26.67,20.32 X12.1
N$91
  Bottom 1.27: Q9.D -16.51,27.94 -19.05,30.48 -26.67,30.48 X25.1
N$92
  Bottom 1.27: Q10.D -16.51,39.37 -17.78,40.64 -26.67,40.64 X26.1
N$93
  Bottom 1.27: Q11.D -16.51,49.53 -17.78,50.8 -26.67,50.8 X23.1
N$94
  Bottom 1.27: Q12.D -16.51,59.69 -17.78,60.96 -26.67,60.96 X24.1
N$95
  Bottom 1.27: Q13.D -16.51,100.33 -17.78,101.6 -26.67,101.6 X21.1
N$96
  Bottom 1.27: Q14.D -16.51,90.17 -17.78,91.44 -26.67,91.44 X22.1
N$97
  Bottom 1.27: Q15.D -16.51,80.01 -17.78,81.28 -26.67,81.28 X19.1
N$98
  Bottom 1.27: R41_220K.1 8.89,127 6.35,129.54 -8.89,129.54 -11.43,127 -11.43,125.78 GND.2 | X2.1 X2.2 67.31,69.85 67.31,64.77 73.66,58.42 Q5.S | Q4.S 86.36,102.87 77.47,114.3 R18_220K.1 | X1.2 X1.1 -5.08,69.85 -5.08,64.77 -11.43,58.42 -12.7,58.42 Q12.S
  Bottom 1.778: Q4.S Q3.S Q1.S Q2.S Q5.S Q6.S Q7.S 86.36,-15.24 81.28,-15.24 78.74,-12.7 78.74,-5.08 77.47,-3.81 0,-3.81 -6.35,-10.16 -6.35,-11.43 -8.89,-13.97 -8.89,-16.51 -10.16,-17.78 -13.97,-17.78 Q10.S | Q10.S Q9.S Q8.S | Q10.S Q11.S Q12.S Q16.S Q15.S Q14.S Q13.S
  Bottom 2.54: GND.1 GND.2 -11.43,125.73 -11.43,118.11 D2.A -13.97,124.46 -16.51,124.46 -16.51,118.11 D1.A | C2.- -6.35,114.3 -8.89,116.84 D1.A | -15.24,111.76 C1_100NF1.2 -24.13,111.76 C1.- | -15.24,111.76 C1_100NF2.1 | C1_100NF2.1 -11.43,116.84 | C1_100NF2.1 -7.62,111.76 -8.89,113.03 -8.89,114.3 -10.16,115.57 -10.16,119.38 D1.A | Q13.S -13.97,102.87 -15.24,104.14 -15.24,111.76
N$99
  Bottom 2.54: X16.2 104.12,99.04 104.14,99.06 105.41,97.79 105.41,90.17 104.14,88.9 101.6,88.9 X15.2 104.16,88.88 105.41,87.63 105.41,80.01 104.14,78.74 101.6,78.74 X18.2 104.16,78.72 105.41,77.47 105.41,69.85 104.14,68.58 101.6,68.58 X17.2 104.16,68.56 105.41,67.31 105.41,59.69 104.14,58.42 101.6,58.42 X13.2 104.16,58.4 105.41,57.15 105.41,49.53 104.14,48.26 101.6,48.26 X14.2 104.16,48.24 105.41,46.99 105.41,39.37 104.14,38.1 101.6,38.1 X11.2 104.16,38.08 105.41,36.83 105.41,29.21 104.14,27.94 101.6,27.94 X9.2 104.16,27.92 105.41,26.67 105.41,19.05 104.14,17.78 101.6,17.78 X8.2 104.16,17.76 105.41,16.51 105.41,8.89 104.14,7.62 101.6,7.62 X10.2 104.16,7.6 105.41,6.35 105.41,-1.27 104.14,-2.54 101.6,-2.54 X7.2 104.16,-2.56 105.41,-3.81 105.41,-11.43 104.14,-12.7 | 104.14,-12.7 101.6,-12.7 X4.2 | 104.14,-12.7 105.41,-13.97 105.41,-21.59 74.93,-21.59 73.64,-20.3 X6.2 73.64,-20.34 72.39,-21.59 64.77,-21.59 63.5,-20.32 63.5,-17.78 X5.2 63.48,-19.07 60.96,-21.59 54.61,-21.59 53.34,-20.32 53.34,-17.78 X3.2 53.32,-20.34 52.07,-21.59 44.45,-21.59 43.18,-20.32 43.18,-17.78 X28.2 43.16,-20.34 41.91,-21.59 34.29,-21.59 33.02,-20.32 33.02,-17.78 X27.2 33,-20.34 31.75,-21.59 24.13,-21.59 24.13,-20.32 22.86,-19.05 22.86,-17.78 X30.2 22.84,-21.57 22.86,-21.59 13.97,-21.59 12.7,-20.32 12.7,-17.78 X29.2 12.68,-20.34 11.43,-21.59 3.81,-21.59 2.54,-20.32 2.54,-17.78 X33.2 2.52,-19.07 0,-21.59 -24.13,-21.59 -27.94,-17.78 -27.94,-16.51 X34.2 -30.5,-16.49 -31.75,-15.24 -31.75,-7.62 -30.48,-6.35 -27.94,-6.35 X31.2 -30.5,-6.33 -31.75,-5.08 -31.75,2.54 -30.48,3.81 -27.94,3.81 X32.2 -30.5,3.83 -31.75,5.08 -31.75,12.7 -30.48,13.97 -27.94,13.97 X12.2 -30.5,13.99 -31.75,15.24 -31.75,22.86 -30.48,24.13 -27.94,24.13 X25.2 -30.5,24.15 -31.75,25.4 -31.75,33.02 -30.48,34.29 -27.94,34.29 X26.2 -30.5,34.31 -31.75,35.56 -31.75,43.18 -30.48,44.45 -27.94,44.45 X23.2 -30.5,44.47 -31.75,45.72 -31.75,53.34 -30.48,54.61 -27.94,54.61 X24.2 -30.5,54.63 -31.75,55.88 -31.75,63.5 -30.48,64.77 -27.94,64.77 X20.2 -30.5,64.79 -31.75,66.04 -31.75,73.66 -30.48,74.93 -27.94,74.93 X19.2 -30.5,74.95 -31.75,76.2 -31.75,83.82 -30.48,85.09 -27.94,85.09 X22.2 -30.5,85.11 -31.75,86.36 -31.75,93.98 -30.48,95.25 -27.94,95.25 X21.2 -30.5,95.27 -31.75,96.52 -31.75,113.03
  Bottom 2.54: -31.75,113.03 -31.75,124.46 -30.48,125.73 -29.26,125.73 +12V.1 +12V.2 | C1.+ D2.C -29.21,124.46 -24.13,124.46 -24.13,121.92 -27.94,121.92 -27.94,113.03 -31.75,113.03 | C1.+ -29.21,107.95 | C1.+ -29.21,106.68 -27.94,105.41 | -27.94,105.41 -30.48,105.41 | -27.94,105.41 -19.05,105.41 C1_100NF1.1
N$100  (via drill 0.6)
  Top 1.27: v54.61,67.31 v3.81,101.6
  Bottom 1.27: X2.4 X2.3 v54.61,67.31 | v3.81,101.6 0,104.14
  Bottom 2.54: +5V.1 +5V.2 1.25,123.21 1.27,123.19 -3.81,123.19 | -3.81,123.19 -3.81,124.46 | -3.81,123.19 -3.81,120.65 0,120.65 1.27,121.92 1.27,119.38 -3.81,119.38 -3.81,118.11 D1.C 0,116.84 0,106.68 | C1_100NF2.2 -8.89,104.14 0,104.14 0,106.68 | -1.27,116.84 C2.+ -1.27,105.41 0,106.68
N$101
  Bottom 1.27: R41_220K.2 8.89,116.84 13.97,121.92 C2_100NF.2 15.24,124.46 17.78,127 28.93,127 29.21,126.72 | 29.21,126.72 S1_PA0.1 | 29.21,126.72 S1_PA0.2 39.09,126.72 40.64,128.27 | 40.64,128.27 R42_330R.2 | X36_PA0.2 102.87,125.78 102.87,127 99.06,130.81 43.18,130.81 40.64,128.27
N$102
  Bottom 1.27: C2_100NF.1 16.51,116.84 20.32,120.65 R40_100R.1
N$103
  Bottom 1.27: Q16.D -16.51,68.58 -17.78,71.12 -26.67,71.12 X20.1
N$104
  Bottom 1.27: X39_PA1.2 87.61,125.71 85.09,123.19 74.93,123.19 R18_220K.2 71.12,124.46 C1_100NF.2 67.31,120.65 60.96,120.65 59.41,122.2 S2_PA1.1 S2_PA1.2 49.81,121.92 48.26,121.92 R19_330R.2
N$105
  Bottom 1.27: R17_100R.1 66.04,114.3 C1_100NF.1
N$106  (via drill 0.6)
  Top 1.27: v16.51,67.31 v31.75,67.31
  Bottom 1.27: R40_100R.2 20.6,114.3 S1_PA0.3 S1_PA0.4 35.28,121.92 36.83,121.92 38.1,120.65 41.91,120.65 43.18,121.92 | X36_PA0.1 95.25,128.27 83.82,128.27 82.53,126.98 X39_PA1.1 81.28,127 66.04,127 R17_100R.2 63.5,125.73 62.23,127 55.6,127 S2_PA1.3 S2_PA1.4 44.17,126.72 43.18,125.73 43.18,121.92 | 3.81,67.31 X1.3 X1.4 v16.51,67.31 | v31.75,67.31 31.75,99.06 43.18,110.49 48.26,110.49 49.53,111.76 49.53,115.57 43.18,121.92
N$107  (via drill 0.6)
  Top 1.27: v0,82.55 v0,57.15
  Bottom 1.27: R19_330R.1 43.18,116.84 39.37,116.84 26.67,101.6 26.67,83.82 25.4,82.55 v0,82.55 | v0,57.15 X1.11
N$108  (via drill 0.6)
  Top 1.27: v29.21,57.15 v16.51,57.15
  Bottom 1.27: R42_330R.1 29.21,100.33 v29.21,57.15 | v16.51,57.15 X1.12
(copper drawn outside any net)
  shapes: Bottom circle x5

### Text on the board
Top: PE14 | PE0 | PE12 | PE2 | PE10 | PE4 | PE8 | PE6 | PE7 | PE5 | PE9 | PE3 | PE11 | PE1 | PE13 | PD6 | PE15 | PD4 | PD9 | AD2 | PD11 | PD0 | PD13 | AD1 | PD15 | PD14 | PD12 | PD10 | PD8 | PD7 | PD5 | AD3
Bottom: +12 | GND | +5V | PA1 | PA0 | PA0 | PA1